# Altium schematic sheet TP_IHM_MAIN.SchDoc
size A4
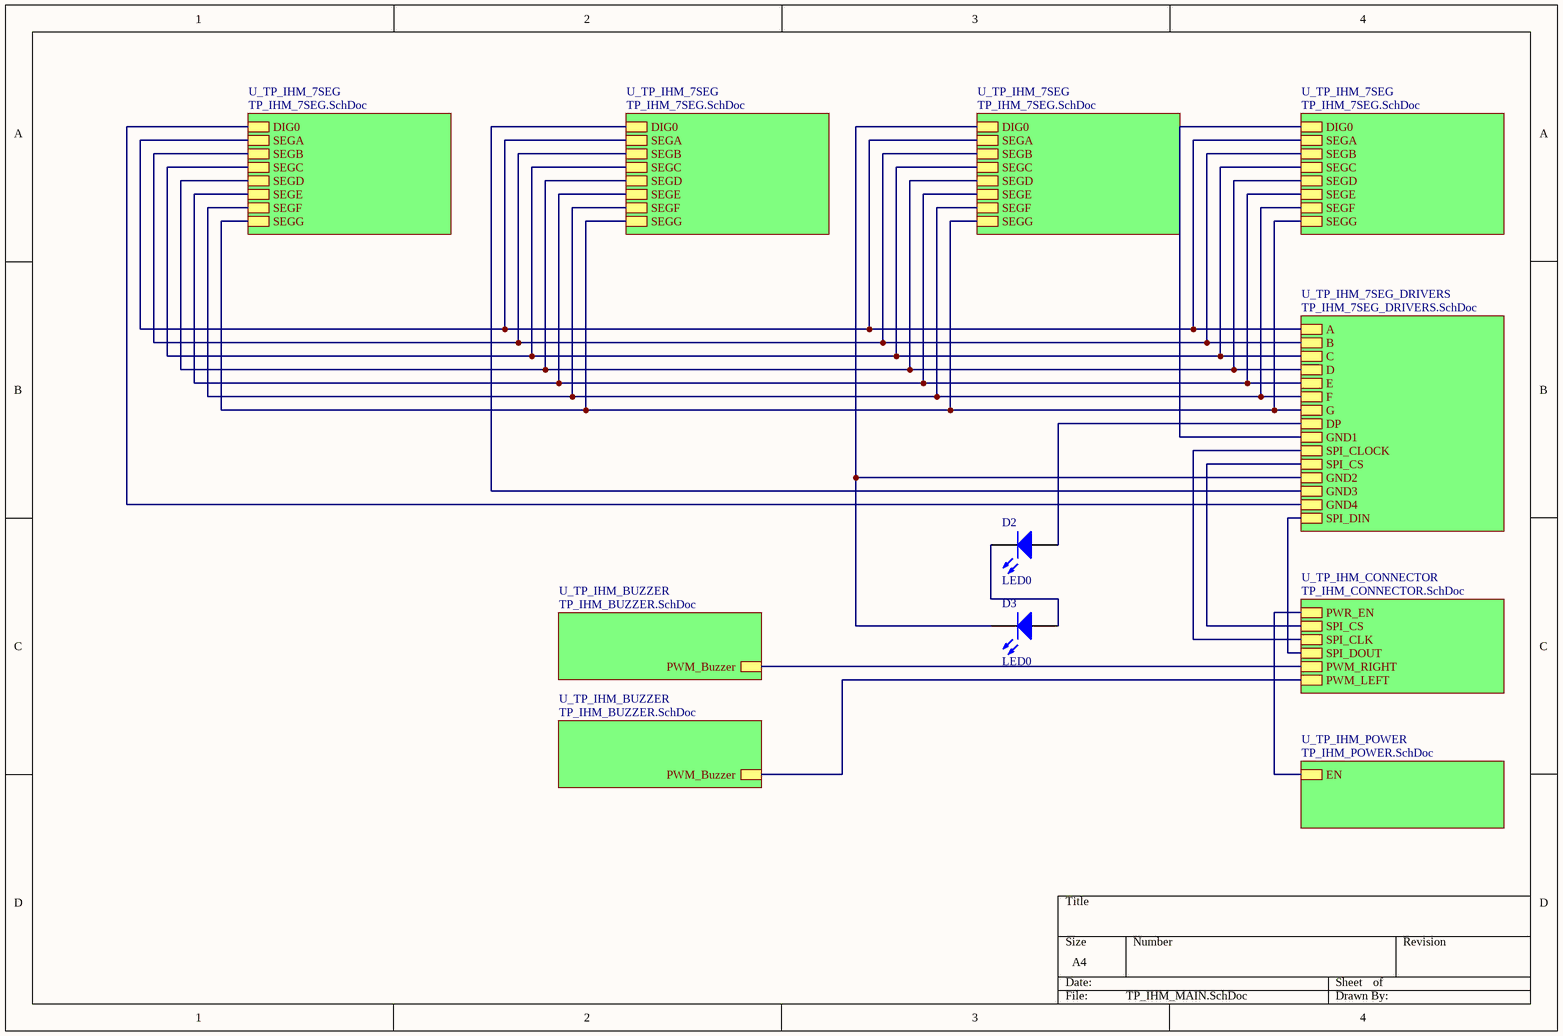
[diagram p0: TP_IHM_MAIN.SchDoc]

## Parts
D2  LED0  [LED-0]
D3  LED0  [LED-0]

## Sub-sheets
U_TP_IHM_7SEG = TP_IHM_7SEG.SchDoc: DIG0, SEGA, SEGB, SEGC, SEGD, SEGE, SEGF, SEGG
U_TP_IHM_7SEG = TP_IHM_7SEG.SchDoc: DIG0, SEGA, SEGB, SEGC, SEGD, SEGE, SEGF, SEGG
U_TP_IHM_7SEG = TP_IHM_7SEG.SchDoc: DIG0, SEGA, SEGB, SEGC, SEGD, SEGE, SEGF, SEGG
U_TP_IHM_7SEG = TP_IHM_7SEG.SchDoc: DIG0, SEGA, SEGB, SEGC, SEGD, SEGE, SEGF, SEGG
U_TP_IHM_7SEG_DRIVERS = TP_IHM_7SEG_DRIVERS.SchDoc: A, B, C, D, E, F, G, GND1, SPI_CLOCK, SPI_CS, GND2, GND3, GND4, SPI_DIN, DP
U_TP_IHM_BUZZER = TP_IHM_BUZZER.SchDoc: PWM_Buzzer
U_TP_IHM_BUZZER = TP_IHM_BUZZER.SchDoc: PWM_Buzzer
U_TP_IHM_CONNECTOR = TP_IHM_CONNECTOR.SchDoc: PWR_EN, SPI_CS, SPI_CLK, SPI_DOUT, PWM_RIGHT, PWM_LEFT
U_TP_IHM_POWER = TP_IHM_POWER.SchDoc: EN

## Nets
NetD2_1: D2.1(A) ; sheet U_TP_IHM_7SEG_DRIVERS/DP
NetD2_2: D2.2(K) D3.1(A)
NetD3_2: D3.2(K) ; sheet U_TP_IHM_7SEG_DRIVERS/GND2, sheet U_TP_IHM_7SEG/DIG0
(unnamed): sheet U_TP_IHM_BUZZER/PWM_Buzzer, sheet U_TP_IHM_CONNECTOR/PWM_RIGHT
(unnamed): sheet U_TP_IHM_CONNECTOR/PWR_EN, sheet U_TP_IHM_POWER/EN
(unnamed): sheet U_TP_IHM_CONNECTOR/SPI_CS, sheet U_TP_IHM_7SEG_DRIVERS/SPI_CS
(unnamed): sheet U_TP_IHM_CONNECTOR/SPI_CLK, sheet U_TP_IHM_7SEG_DRIVERS/SPI_CLOCK
(unnamed): sheet U_TP_IHM_CONNECTOR/SPI_DOUT, sheet U_TP_IHM_7SEG_DRIVERS/SPI_DIN
(unnamed): sheet U_TP_IHM_CONNECTOR/PWM_LEFT, sheet U_TP_IHM_BUZZER/PWM_Buzzer
(unnamed): sheet U_TP_IHM_7SEG_DRIVERS/A, sheet U_TP_IHM_7SEG/SEGA, sheet U_TP_IHM_7SEG/SEGA, sheet U_TP_IHM_7SEG/SEGA, sheet U_TP_IHM_7SEG/SEGA
(unnamed): sheet U_TP_IHM_7SEG_DRIVERS/B, sheet U_TP_IHM_7SEG/SEGB, sheet U_TP_IHM_7SEG/SEGB, sheet U_TP_IHM_7SEG/SEGB, sheet U_TP_IHM_7SEG/SEGB
(unnamed): sheet U_TP_IHM_7SEG_DRIVERS/C, sheet U_TP_IHM_7SEG/SEGC, sheet U_TP_IHM_7SEG/SEGC, sheet U_TP_IHM_7SEG/SEGC, sheet U_TP_IHM_7SEG/SEGC
(unnamed): sheet U_TP_IHM_7SEG_DRIVERS/D, sheet U_TP_IHM_7SEG/SEGD, sheet U_TP_IHM_7SEG/SEGD, sheet U_TP_IHM_7SEG/SEGD, sheet U_TP_IHM_7SEG/SEGD
(unnamed): sheet U_TP_IHM_7SEG_DRIVERS/E, sheet U_TP_IHM_7SEG/SEGE, sheet U_TP_IHM_7SEG/SEGE, sheet U_TP_IHM_7SEG/SEGE, sheet U_TP_IHM_7SEG/SEGE
(unnamed): sheet U_TP_IHM_7SEG_DRIVERS/F, sheet U_TP_IHM_7SEG/SEGF, sheet U_TP_IHM_7SEG/SEGF, sheet U_TP_IHM_7SEG/SEGF, sheet U_TP_IHM_7SEG/SEGF
(unnamed): sheet U_TP_IHM_7SEG_DRIVERS/G, sheet U_TP_IHM_7SEG/SEGG, sheet U_TP_IHM_7SEG/SEGG, sheet U_TP_IHM_7SEG/SEGG, sheet U_TP_IHM_7SEG/SEGG
(unnamed): sheet U_TP_IHM_7SEG_DRIVERS/GND1, sheet U_TP_IHM_7SEG/DIG0
(unnamed): sheet U_TP_IHM_7SEG_DRIVERS/GND3, sheet U_TP_IHM_7SEG/DIG0
(unnamed): sheet U_TP_IHM_7SEG_DRIVERS/GND4, sheet U_TP_IHM_7SEG/DIG0

## Library data of the parts
D2 D3 = LED0: Typical INFRARED GaAs LED; Published: 8-Jun-2000; LatestRevisionDate: 08-Jul-2005; LatestRevisionNote: Mech Layer 1 removed.; PackageReference: LED-0; Publisher: Altium Limited; PackageDescription: LED; 2 Leads